# Altium schematic sheet Chip.SchDoc
size 999 x 800 mm; SheetNumber: 8; SheetTotal: 9
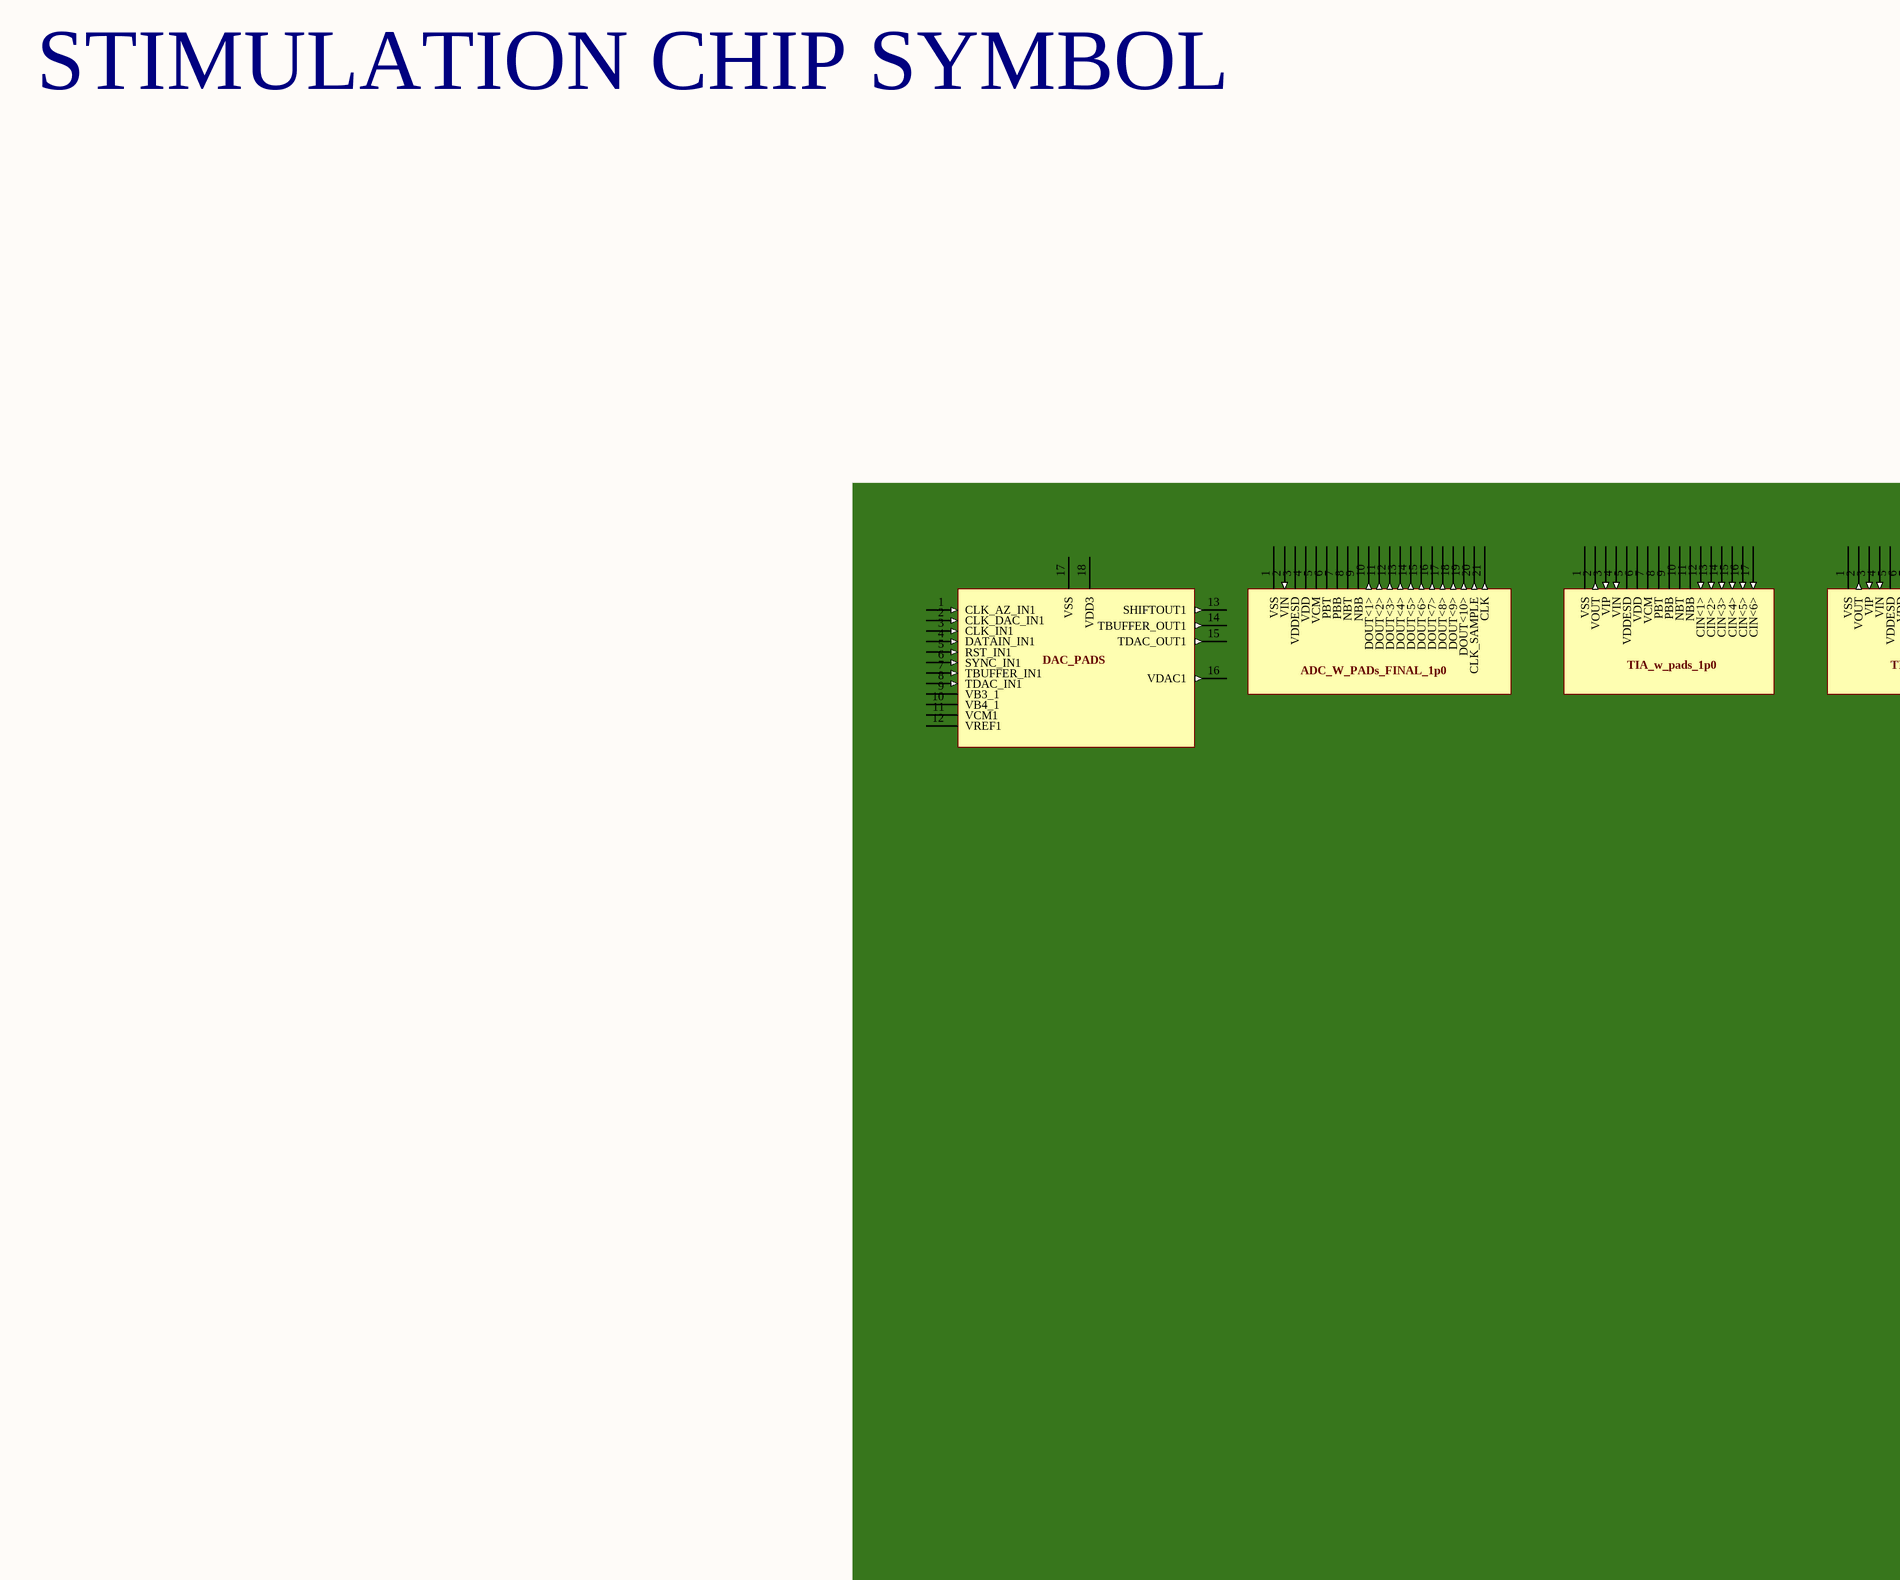
[diagram p0: Chip.SchDoc, top left]
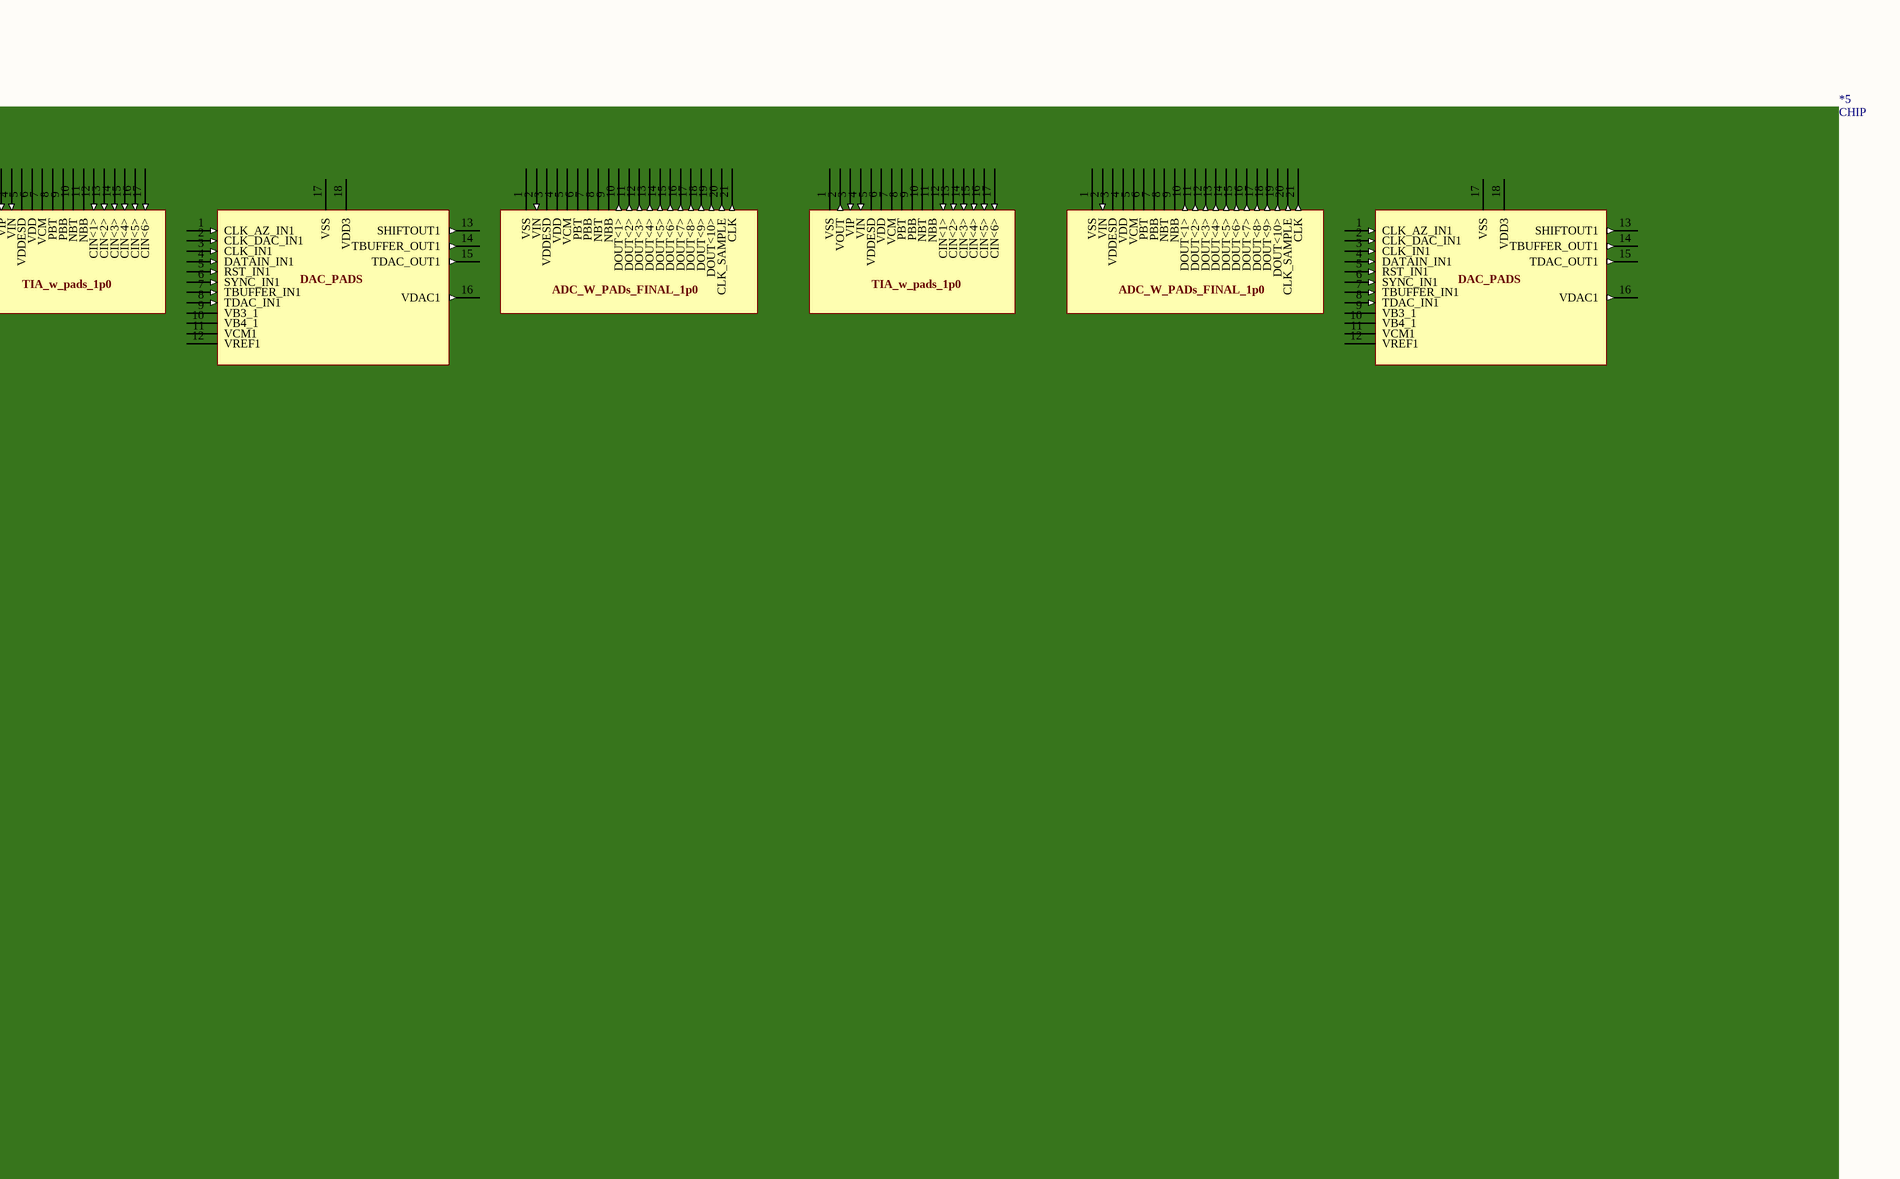
[diagram p1: Chip.SchDoc, top right]
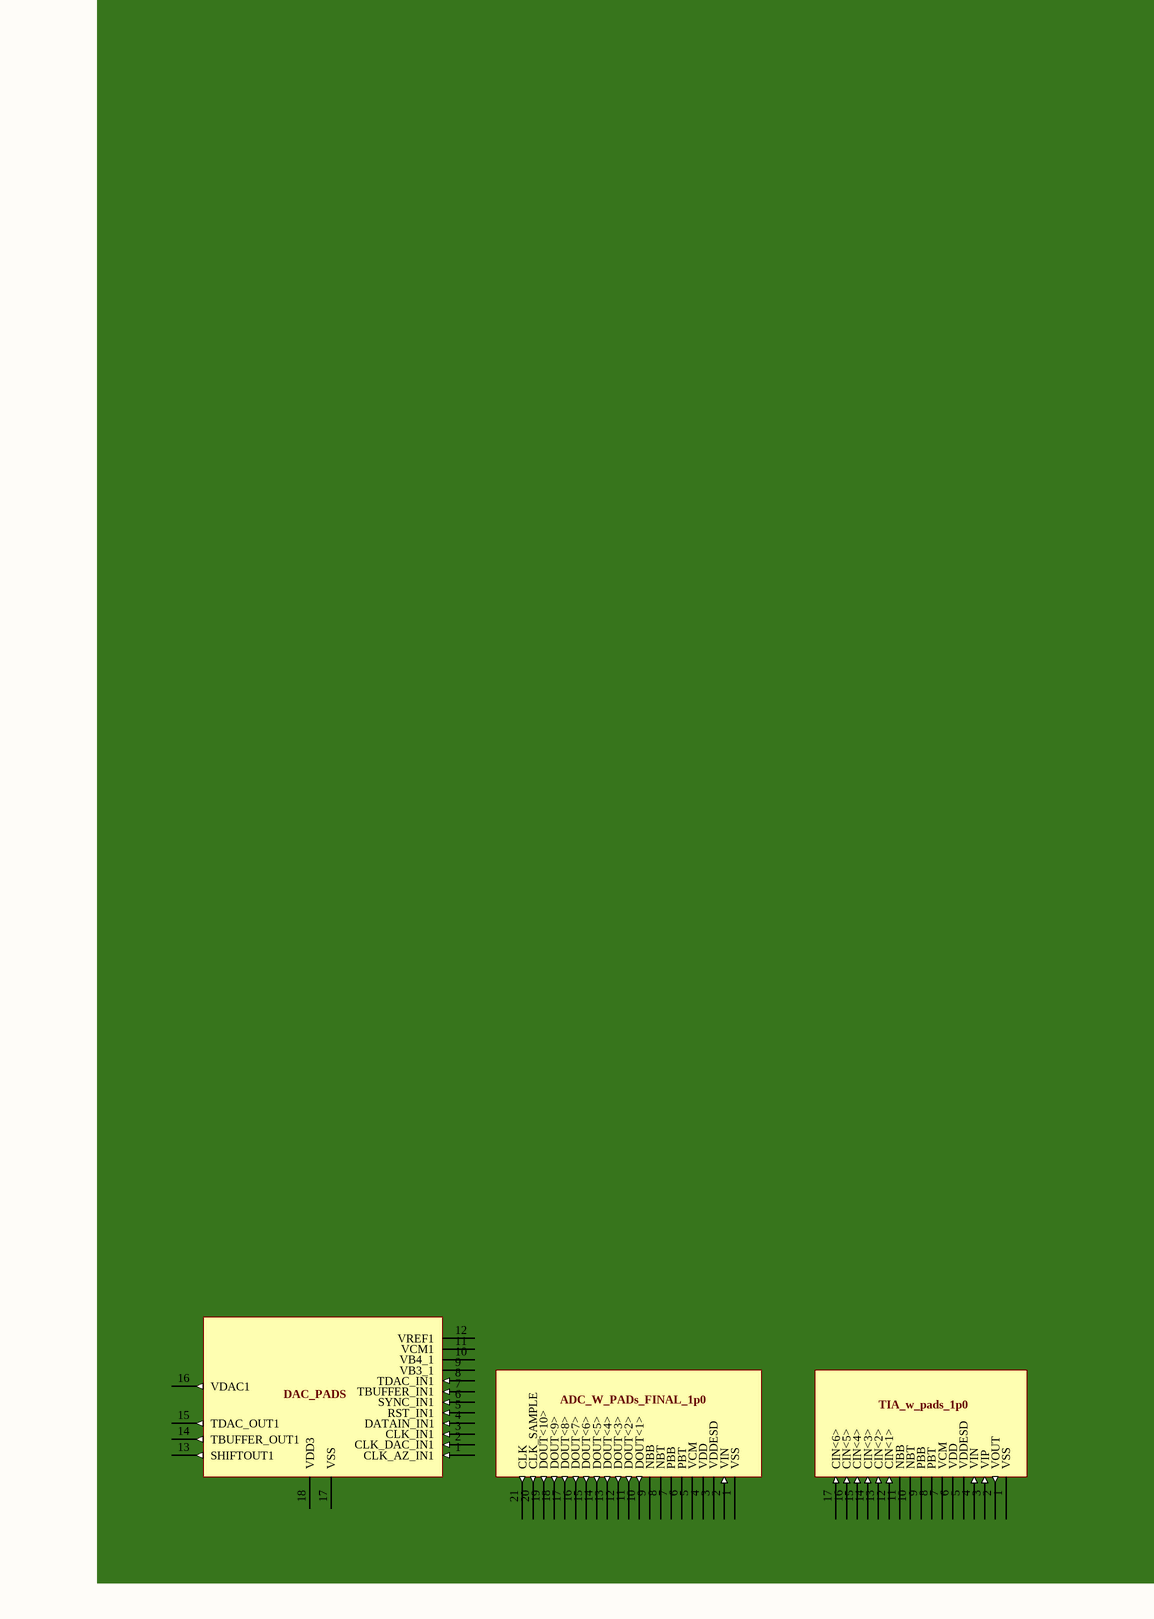
[diagram p2: Chip.SchDoc, bottom left]
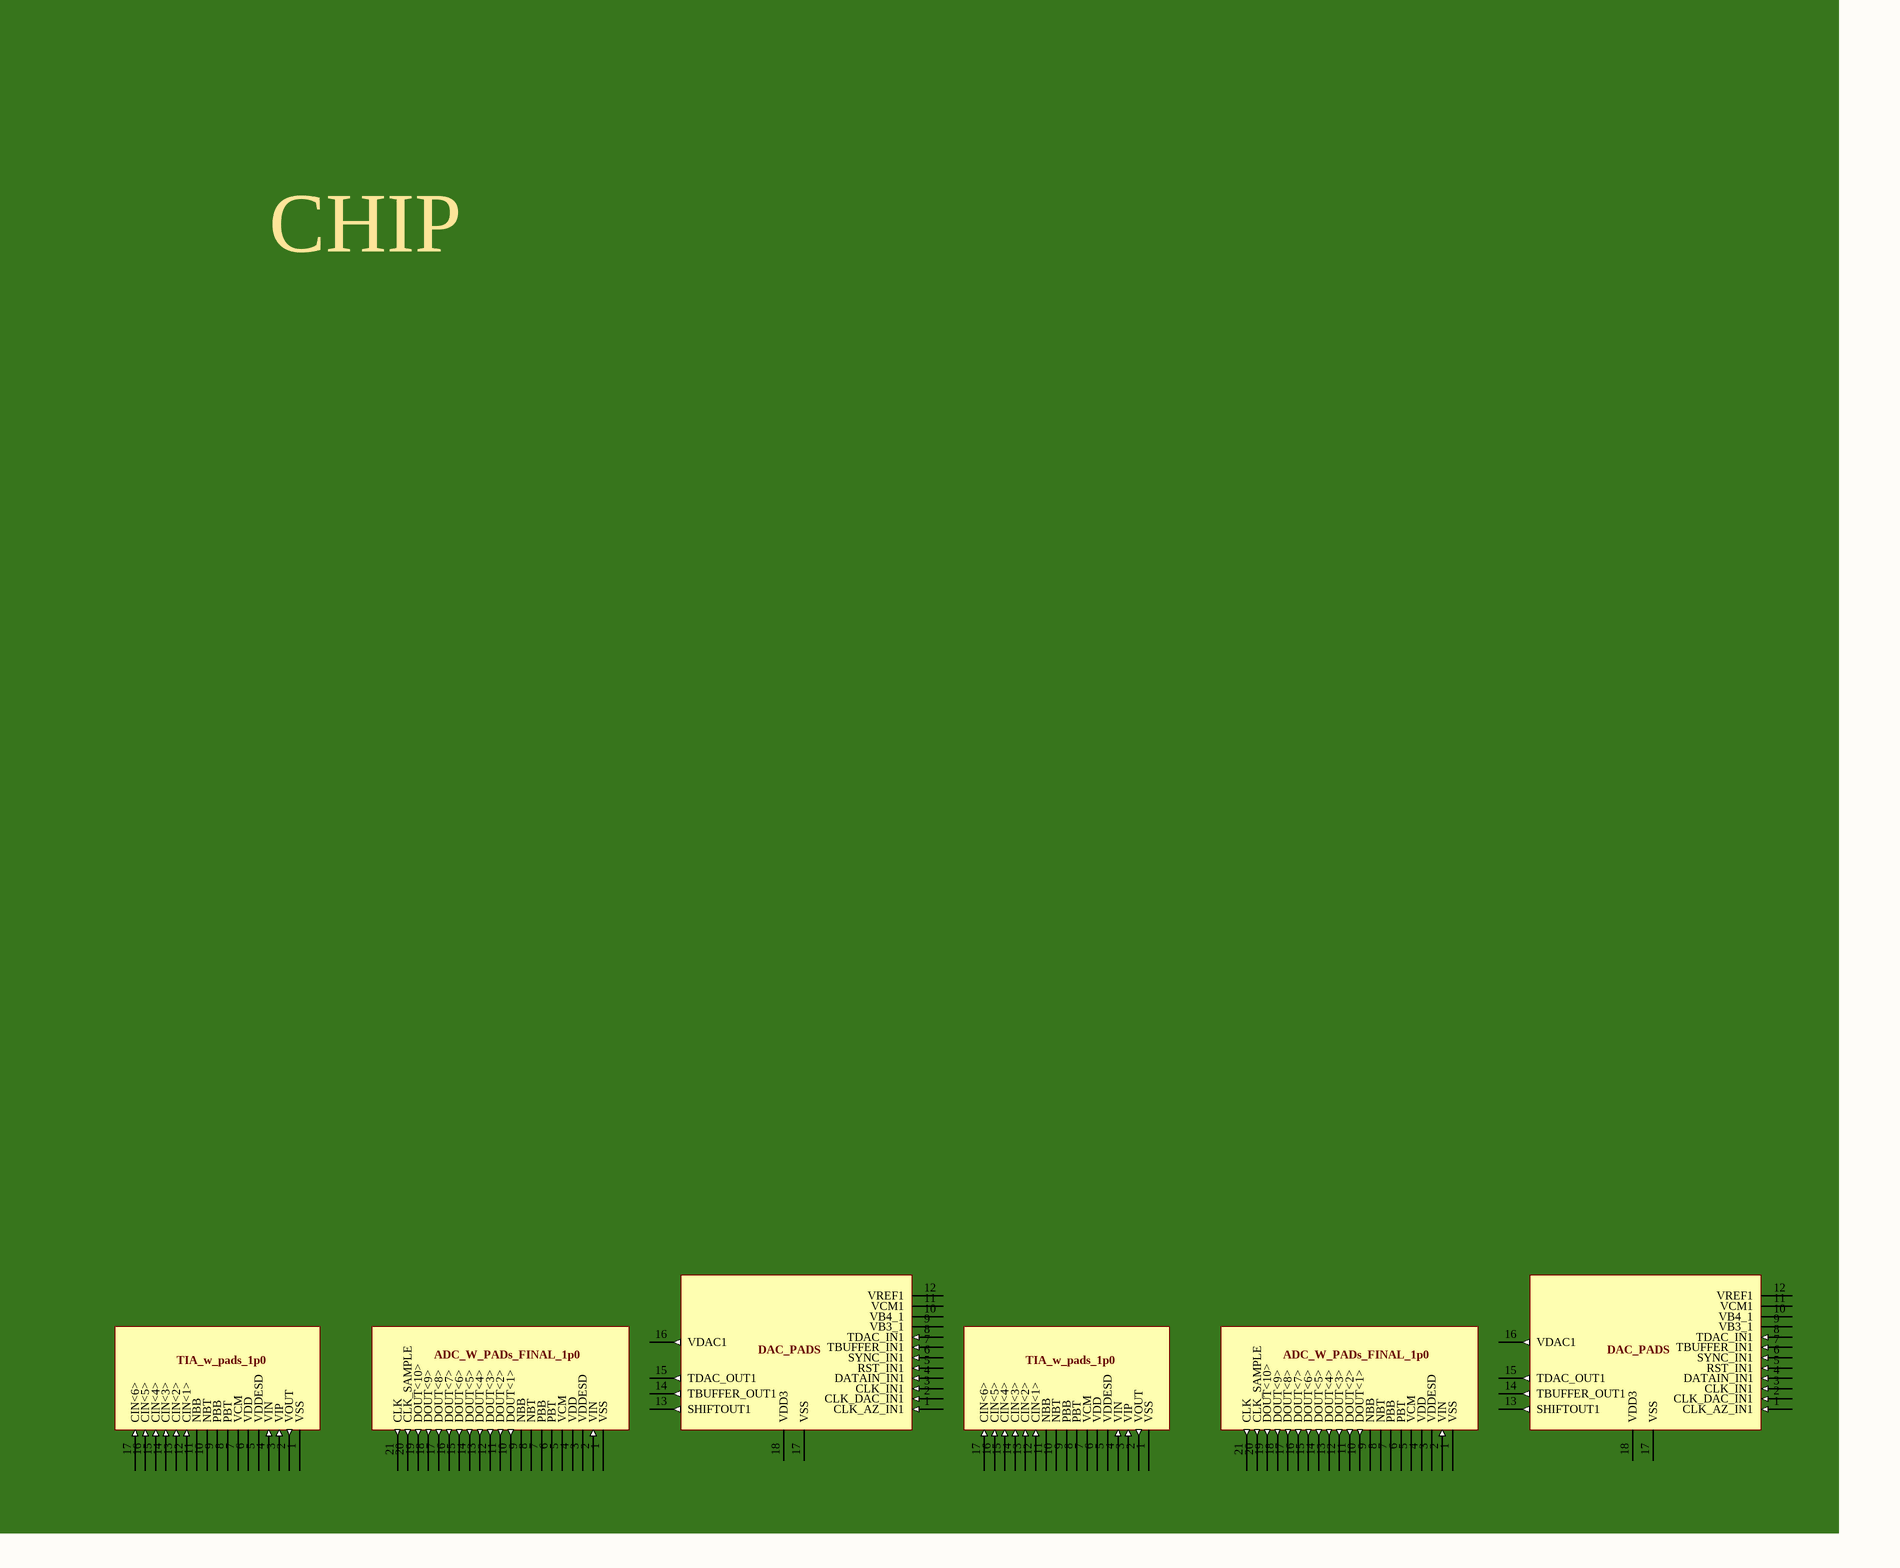
[diagram p3: Chip.SchDoc, bottom right]

## Parts
*5  CHIP

## Nets

Not connected (* = marked no-connect by the designer): *5 1(VSS) 2(VIN) 3(VDDESD) 4(VDD) 5(VCM) 6(PBT) 7(PBB) 8(NBT) 9(NBB) 10(DOUT<1>) 11(DOUT<2>) 12(DOUT<3>) 13(DOUT<4>) 14(DOUT<5>) 15(DOUT<6>) 16(DOUT<7>) 17(DOUT<8>) 18(DOUT<9>) 19(DOUT<10>) 20(CLK_SAMPLE) 21(CLK)

## Notes on the sheet
- STIMULATION CHIP SYMBOL
- (in symbol CHIP) DAC_PADS; TIA_w_pads_1p0; ADC_W_PADs_FINAL_1p0